# EAGLE design picoWiCopter (EAGLE 6.3)
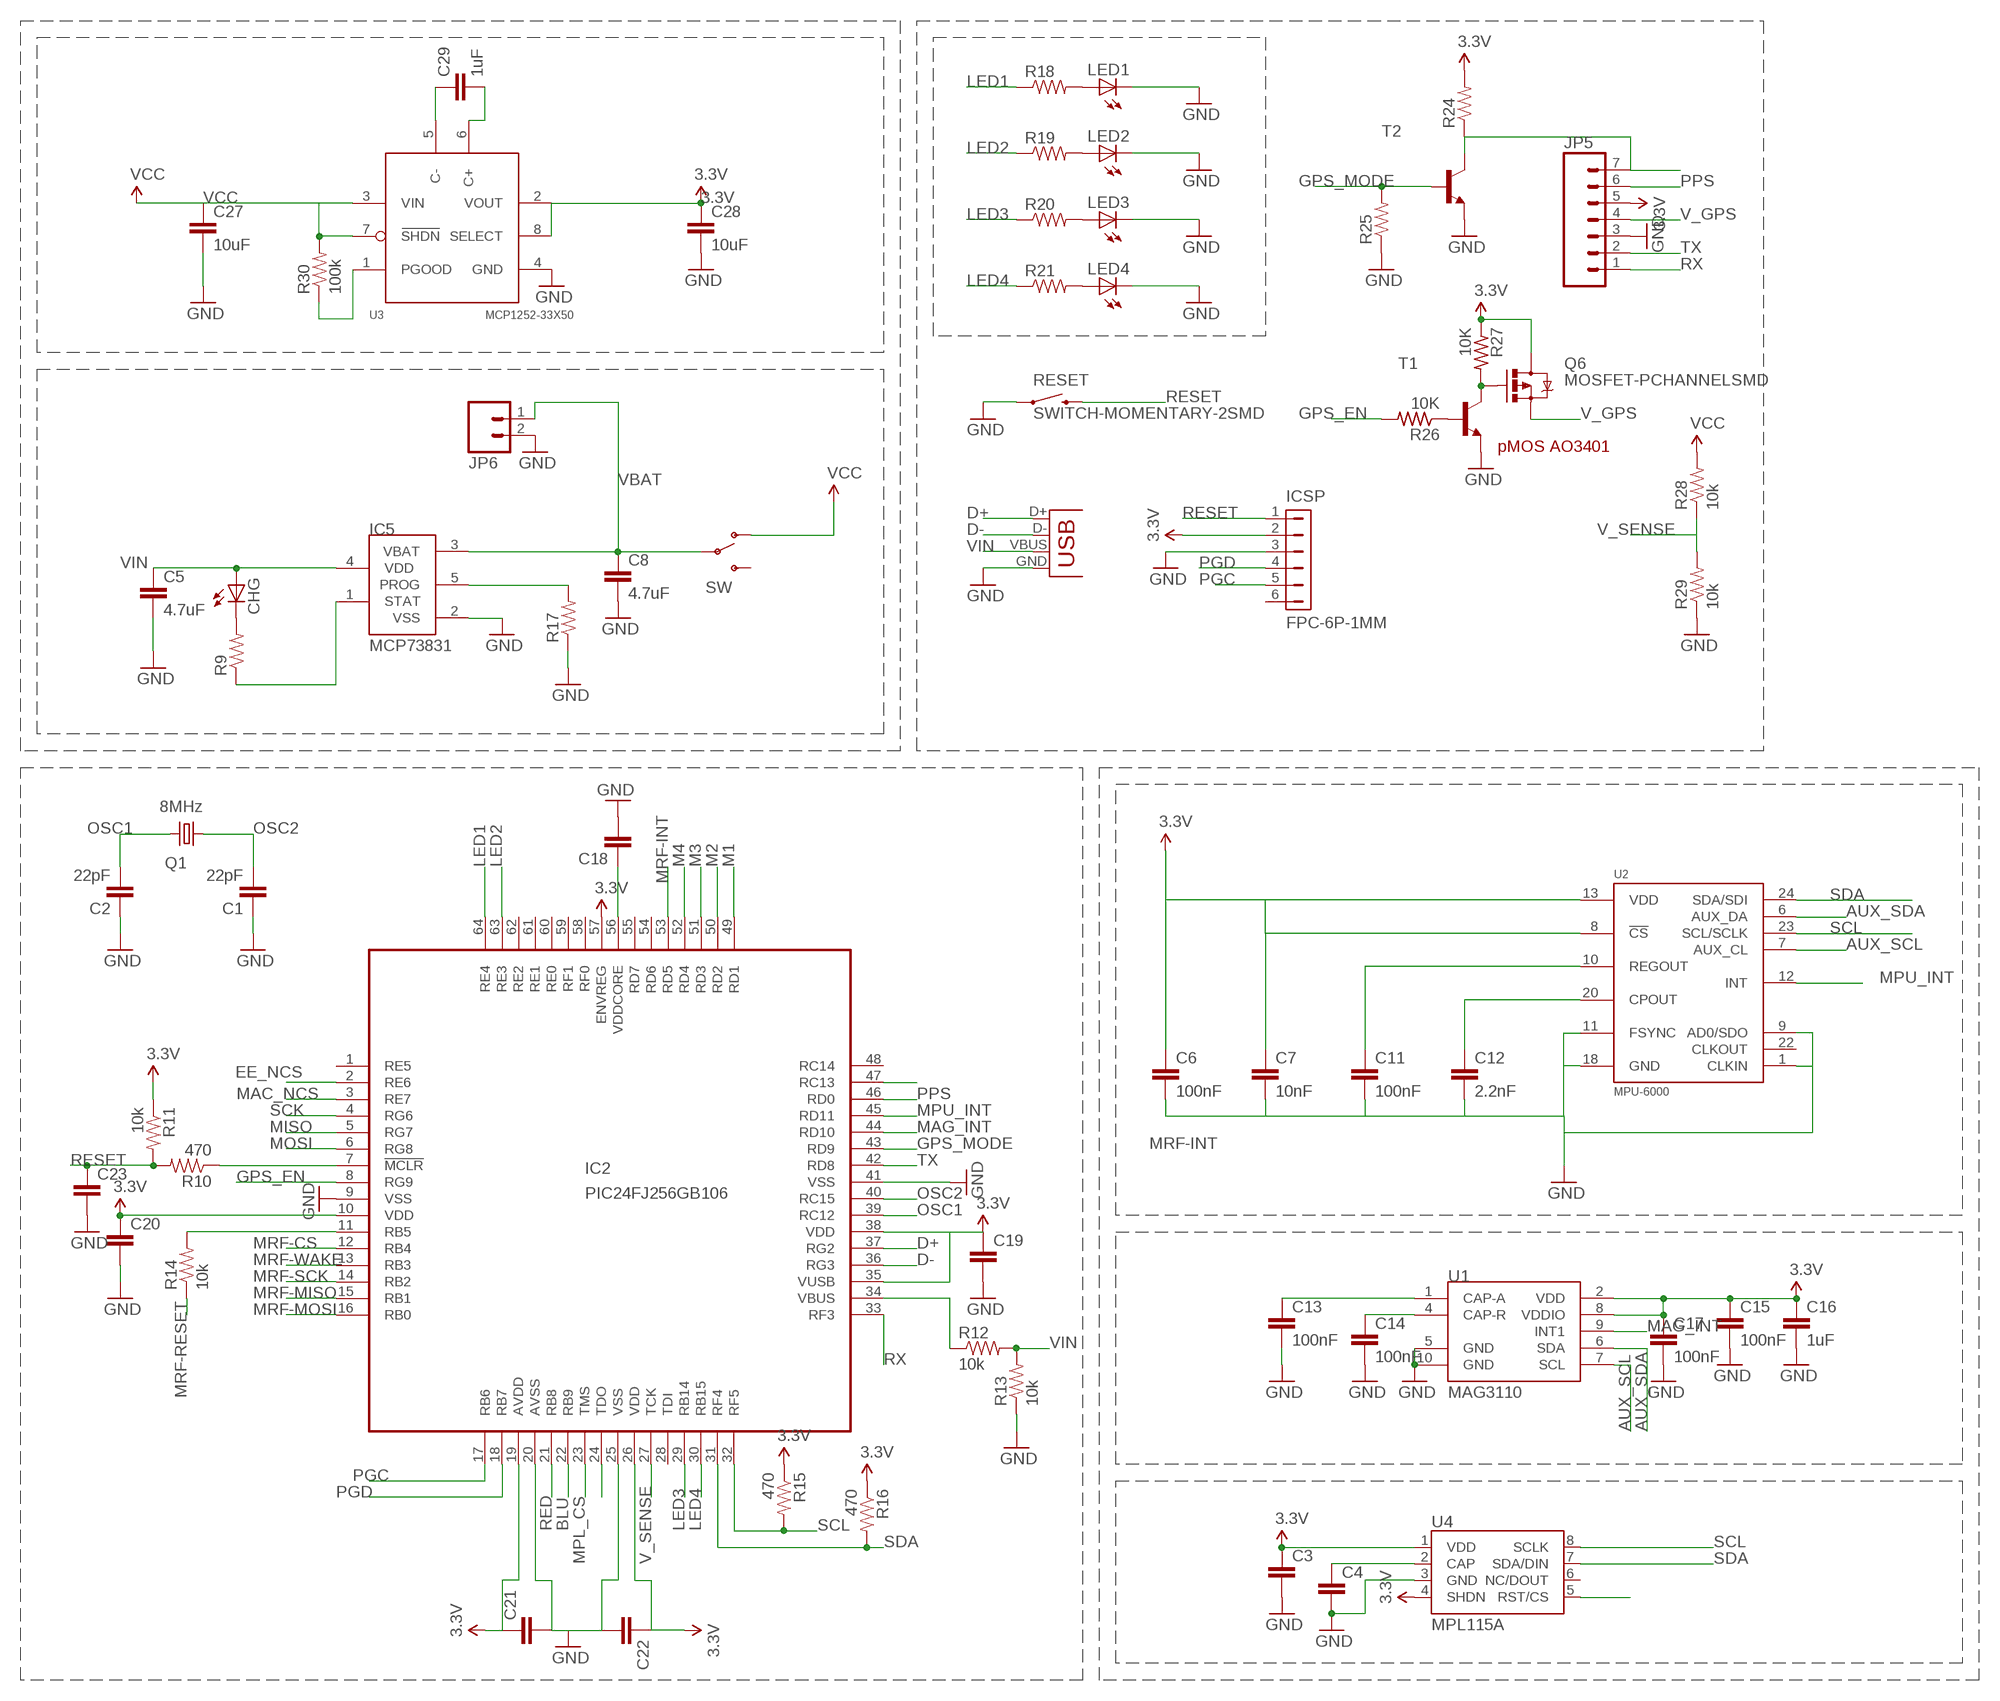
[diagram p0: schematic, sheet 1, part 1 of 2]
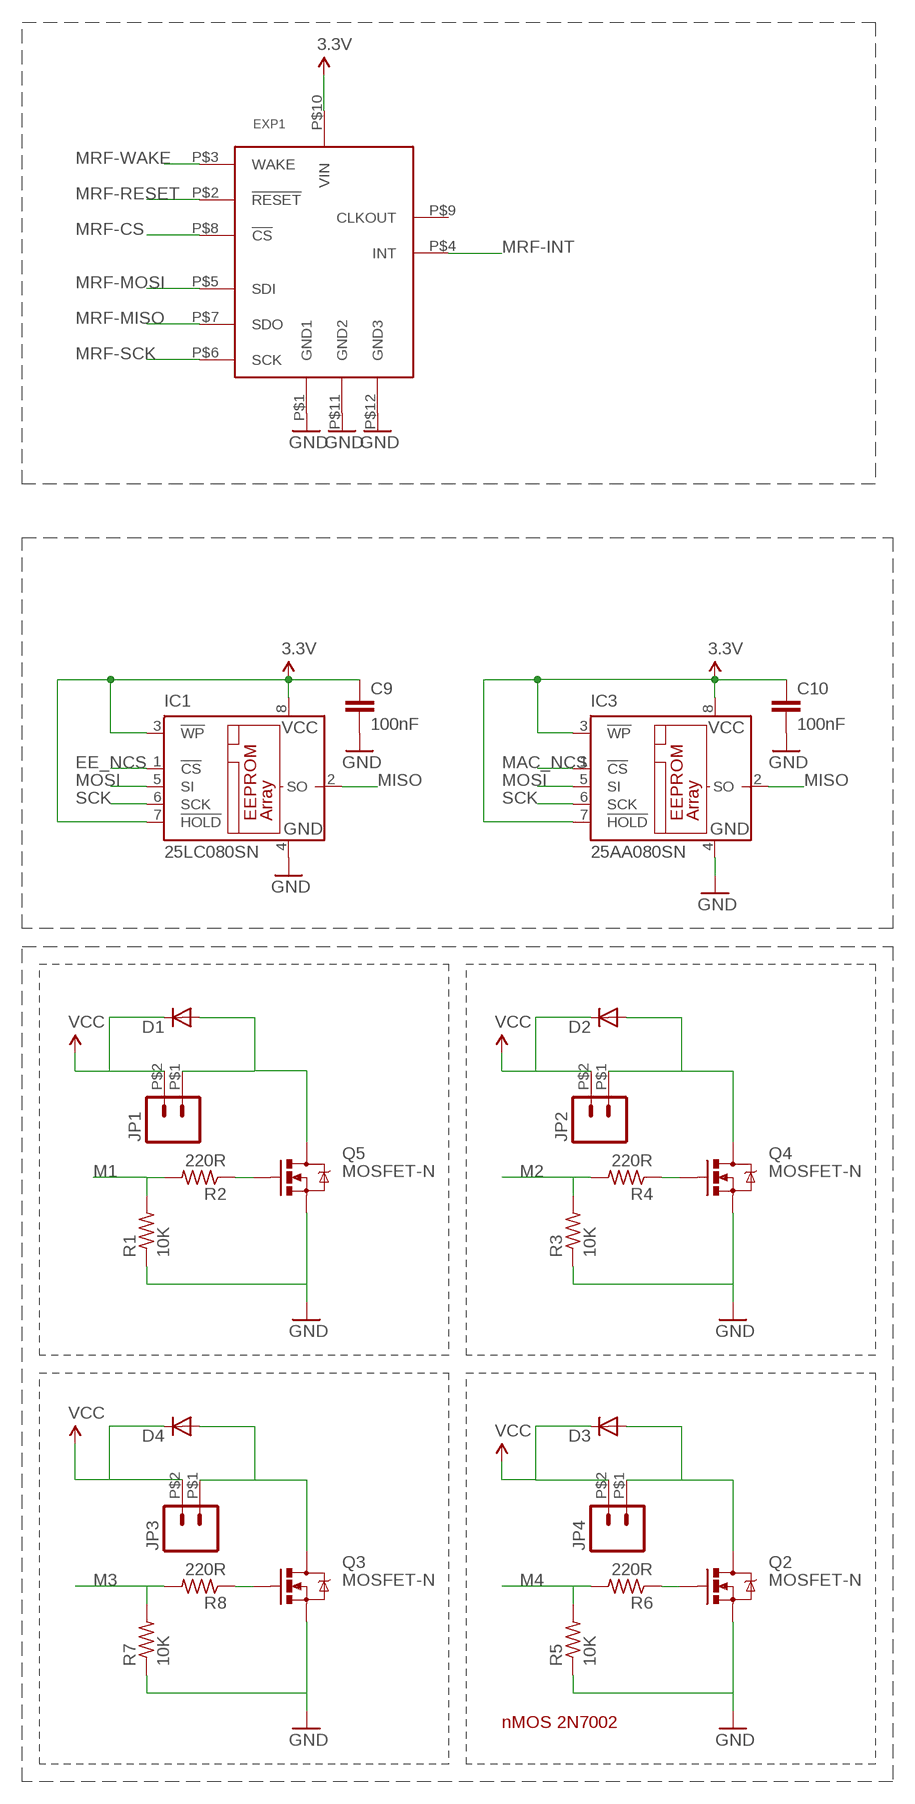
[diagram p1: schematic, sheet 1, part 2 of 2]

## Parts
C1  22pF  CAP0603-CAP  [0603-CAP]
C2  22pF  CAP0603-CAP  [0603-CAP]
C3  CAP0603-CAP  [0603-CAP]
C4  CAP0603-CAP  [0603-CAP]
C5  4.7uF  C-EUC1206  [C1206]
C6  100nF  CAP0603-CAP  [0603-CAP]
C7  10nF  CAP0603-CAP  [0603-CAP]
C8  4.7uF  C-EUC1206  [C1206]
C9  100nF  CAP0603-CAP  [0603-CAP]
C10  100nF  CAP0603-CAP  [0603-CAP]
C11  100nF  CAP0603-CAP  [0603-CAP]
C12  2.2nF  CAP0603-CAP  [0603-CAP]
C13  100nF  CAP0603-CAP  [0603-CAP]
C14  100nF  CAP0603-CAP  [0603-CAP]
C15  100nF  CAP0603-CAP  [0603-CAP]
C16  1uF  CAP0603-CAP  [0603-CAP]
C17  100nF  CAP0603-CAP  [0603-CAP]
C18  CAP1206  [1206]
C19  CAP0603-CAP  [0603-CAP]
C20  CAP0603-CAP  [0603-CAP]
C21  CAP0603-CAP  [0603-CAP]
C22  CAP0603-CAP  [0603-CAP]
C23  CAP0603-CAP  [0603-CAP]
C27  10uF  CAP1206  [1206]
C28  10uF  CAP1206  [1206]
C29  1uF  CAP0603-CAP  [0603-CAP]
CHG  LEDCHIP-LED0603  [CHIP-LED0603]
D1  DIODE-MINIMELF  [MINIMELF]
D2  DIODE-MINIMELF  [MINIMELF]
D3  DIODE-MINIMELF  [MINIMELF]
D4  DIODE-MINIMELF  [MINIMELF]
EXP1  MRF24J40MA"  [MRF24J40MA]
IC1  25LC080SN  [SO-08]
IC2  PIC24FJ256GB106  [TQFP64-10X10]
IC3  25AA080SN  [SO-08]
IC5  MCP73831  [SOT23-5L]
ICSP  FPC-6P-1MM  [FPC-6P-1MM]
JP1  M02  [1X2SMD]
JP2  M02  [1X2SMD]
JP3  M02  [1X2SMD]
JP4  M02  [1X2SMD]
JP5  M07  [1X07]
JP6  M02PTH  [1X02]
LED1  LED0603  [LED-0603]
LED2  LED0603  [LED-0603]
LED3  LED0603  [LED-0603]
LED4  LED0603  [LED-0603]
Q1  8MHz  CRYSTALCTS406  [CTS406]
Q2  MOSFET-N  MOSFET-NCHANNELSMD  [SOT23-3]
Q3  MOSFET-N  MOSFET-NCHANNELSMD  [SOT23-3]
Q4  MOSFET-N  MOSFET-NCHANNELSMD  [SOT23-3]
Q5  MOSFET-N  MOSFET-NCHANNELSMD  [SOT23-3]
Q6  MOSFET-PCHANNELSMD  [SOT23-3]
R1  10K  R-US_R0603  [R0603]
R2  220R  R-US_R0603  [R0603]
R3  10K  R-US_R0603  [R0603]
R4  220R  R-US_R0603  [R0603]
R5  10K  R-US_R0603  [R0603]
R6  220R  R-US_R0603  [R0603]
R7  10K  R-US_R0603  [R0603]
R8  220R  R-US_R0603  [R0603]
R9  RESISTOR0603-RES  [0603-RES]
R10  470  RESISTOR0603-RES  [0603-RES]
R11  10k  RESISTOR0603-RES  [0603-RES]
R12  10k  RESISTOR0603-RES  [0603-RES]
R13  10k  RESISTOR0603-RES  [0603-RES]
R14  10k  RESISTOR0603-RES  [0603-RES]
R15  470  RESISTOR0603-RES  [0603-RES]
R16  470  RESISTOR0603-RES  [0603-RES]
R17  RESISTOR0603-RES  [0603-RES]
R18  RESISTOR0603-RES  [0603-RES]
R19  RESISTOR0603-RES  [0603-RES]
R20  RESISTOR0603-RES  [0603-RES]
R21  RESISTOR0603-RES  [0603-RES]
R24  RESISTOR0603-RES  [0603-RES]
R25  RESISTOR0603-RES  [0603-RES]
R26  10K  R-US_R0603  [R0603]
R27  10K  R-US_R0603  [R0603]
R28  10k  RESISTOR0603-RES  [0603-RES]
R29  10k  RESISTOR0603-RES  [0603-RES]
R30  100k  RESISTOR0603-RES  [0603-RES]
RESET  SWITCH-MOMENTARY-2SMD  [TACTILE_SWITCH_SMD]
SW  SWITCH-SPDTPTH_LOCK  [SWITCH-SPDT_LOCK.007S]
T1  BFR92-NPN-SOT23-BEC  [SOT23-BEC]
T2  BFR92-NPN-SOT23-BEC  [SOT23-BEC]
U1  MAG3110  [DFN-10]
U2  MPU-6000  [QFN-24]
U3  MCP1252-33X50  [MSOP8]
U4  MPL115A  [LGA8]
X3  USBSMD  [USB-MINIB]

## Nets
3.3V: C3.1 C6.1 C7.1 C9.1 C10.1 C15.1 C16.1 C17.1 C19.1 C20.1 C21.1 C22.1 C28.1 EXP1.P$10(VIN) IC1.3(!WP) IC1.7(!HOLD) IC1.8(VCC) IC2.10(VDD) IC2.19(AVDD) IC2.26(VDD) IC2.35(VUSB) IC2.38(VDD) IC2.57(ENVREG) IC3.3(!WP) IC3.7(!HOLD) IC3.8(VCC) ICSP.2 JP5.5 Q6.3(D) R11.1 R15.1 R16.1 R24.2 R27.1 U1.2(VDD) U1.8(VDDIO) U2.8(!CS) U2.13(VDD) U3.2(VOUT) U3.8(SELECT) U4.1(VDD) U4.4(SHDN)
AUX_SCL: U1.7(SCL) U2.7(AUX_CL)
AUX_SDA: U1.6(SDA) U2.6(AUX_DA)
BLU: IC2.22(RB9)
C+1: C29.2 U3.6(C+)
C-1: C29.1 U3.5(C-)
D+: IC2.37(RG2) X3.D+
D-: IC2.36(RG3) X3.D-
EE_NCS: IC1.1(!CS) IC2.2(RE6)
GND: C1.1 C2.1 C3.2 C4.2 C5.2 C6.2 C7.2 C8.2 C9.2 C10.2 C11.2 C12.2 C13.2 C14.2 C15.2 C16.2 C17.2 C18.2 C19.2 C20.2 C21.2 C22.2 C23.2 C27.2 C28.2 EXP1.P$1(GND1) EXP1.P$11(GND2) EXP1.P$12(GND3) IC1.4(GND) IC2.9(VSS) IC2.20(AVSS) IC2.25(VSS) IC2.41(VSS) IC3.4(GND) IC5.2(VSS) ICSP.3 JP5.3 JP6.2 LED1.C LED2.C LED3.C LED4.C Q2.2(S) Q3.2(S) Q4.2(S) Q5.2(S) R1.1 R3.1 R5.1 R7.1 R13.1 R17.1 R25.1 R29.1 RESET.1 T1.E T2.E U1.5(GND) U1.10(GND) U2.1(CLKIN) U2.9(AD0/SDO) U2.11(FSYNC) U2.18(GND) U3.4(GND) U4.3(GND) X3.GND
GPS_EN: IC2.8(RG9) R26.2
GPS_MODE: IC2.43(RD9) R25.2 T2.B
LED1: IC2.64(RE4) R18.1
LED2: IC2.63(RE3) R19.1
LED3: IC2.29(RB14) R20.1
LED4: IC2.30(RB15) R21.1
M1: IC2.49(RD1) R1.2 R2.2
M2: IC2.50(RD2) R3.2 R4.2
M3: IC2.51(RD3) R7.2 R8.2
M4: IC2.52(RD4) R5.2 R6.2
MAC_NCS: IC2.3(RE7) IC3.1(!CS)
MAG_INT: IC2.44(RD10) U1.9(INT1)
MISO: IC1.2(SO) IC2.5(RG7) IC3.2(SO)
MOSI: IC1.5(SI) IC2.6(RG8) IC3.5(SI)
MPL_CS: IC2.23(TMS) U4.5(RST/CS)
MPU_INT: IC2.45(RD11) U2.12(INT)
MRF-CS: EXP1.P$8(!CS) IC2.12(RB4)
MRF-INT: EXP1.P$4(INT) IC2.53(RD5)
MRF-MISO: EXP1.P$7(SDO) IC2.15(RB1)
MRF-MOSI: EXP1.P$5(SDI) IC2.16(RB0)
MRF-RESET: EXP1.P$2(!RESET) R14.1
MRF-SCK: EXP1.P$6(SCK) IC2.14(RB2)
MRF-WAKE: EXP1.P$3(WAKE) IC2.13(RB3)
N$1: IC5.1(STAT) R9.1
N$3: IC2.47(RC13)
N$4: CHG.C R9.2
N$7: C13.1 U1.1(CAP-A)
N$8: C14.1 U1.4(CAP-R)
N$9: D1.A JP1.P$1 Q5.3(D)
N$10: LED1.A R18.2
N$11: C18.1 IC2.56(VDDCORE)
N$12: IC2.34(VBUS) R12.1
N$13: IC2.7(!MCLR) R10.1
N$14: IC2.11(RB5) R14.2
N$15: D2.A JP2.P$1 Q4.3(D)
N$16: C12.1 U2.20(CPOUT)
N$17: C11.1 U2.10(REGOUT)
N$18: LED2.A R19.2
N$20: LED3.A R20.2
N$21: D3.A JP4.P$1 Q2.3(D)
N$22: LED4.A R21.2
N$23: D4.A JP3.P$1 Q3.3(D)
N$24: IC5.5(PROG) R17.2
N$25: JP5.7 R24.1 T2.C
N$26: Q6.1(G) R27.2 T1.C
N$27: R26.1 T1.B
N$29: R30.1 U3.1(PGOOD)
N$35: C4.1 U4.2(CAP)
N$37: IC2.24(TDO)
N$45: Q5.1(G) R2.1
N$46: Q4.1(G) R4.1
N$47: Q2.1(G) R6.1
N$48: Q3.1(G) R8.1
OSC1: C2.2 IC2.39(RC12) Q1.3
OSC2: C1.2 IC2.40(RC15) Q1.1
PGC: IC2.17(RB6) ICSP.5
PGD: IC2.18(RB7) ICSP.4
PPS: IC2.46(RD0) JP5.6
RED: IC2.21(RB8)
RESET: C23.1 ICSP.1 R10.2 R11.2 RESET.3
RX: IC2.33(RF3) JP5.1
SCK: IC1.6(SCK) IC2.4(RG6) IC3.6(SCK)
SCL: IC2.32(RF5) R15.2 U2.23(SCL/SCLK) U4.8(SCLK)
SDA: IC2.31(RF4) R16.2 U2.24(SDA/SDI) U4.7(SDA/DIN)
TX: IC2.42(RD8) JP5.2
V_GPS: JP5.4 Q6.2(S)
V_SENSE: IC2.27(TCK) R28.1 R29.2
VBAT: C8.1 IC5.3(VBAT) JP6.1 SW.2(P)
VCC: C27.1 D1.C D2.C D3.C D4.C JP1.P$2 JP2.P$2 JP3.P$2 JP4.P$2 R28.2 R30.2 SW.1(O) U3.3(VIN) U3.7(SHDN)
VIN: C5.1 CHG.A IC5.4(VDD) R12.2 R13.2 X3.VBUS
Unconnected: EXP1.P$9(CLKOUT) IC2.1(RE5) IC2.28(TDI) IC2.48(RC14) IC2.54(RD6) IC2.55(RD7) IC2.58(RF0) IC2.59(RF1) IC2.60(RE0) IC2.61(RE1) IC2.62(RE2) ICSP.6 SW.3(S) U2.22(CLKOUT) U4.6(NC/DOUT)

## Notes on the sheet
- pMOS AO3401
- VBAT
- nMOS 2N7002

## Library data of the parts
C1-C4 C6 C7 C9-C23 C27-C29 = SparkFun-Passives:CAP: Capacitor Standard 0603 ceramic capacitor, and 0.1" leaded capacitor.
C5 C8 = resistor:C-EU: CAPACITOR, European symbol
CHG = led:LED: LED OSRAM: - CHIPLED LG R971, LG N971, LY N971, LG Q971, LY Q971, LO R971, LY R971 LH N974, LH R974 LS Q976, LO Q976, LY Q976 LO Q996 - Hyper CHIPLED LW Q18S LB Q993, LB Q99A, LB R99A - SideLED LS A670, LO A670, LY A670, LG A670, LP A670 LB A673, LV A673, LT A673, LW A673 LH A674 LY A675 LS A676, LA A676, LO A676, LY A676, LW A676 LS A679, LY A679, LG A679 - Hyper Micro SIDELED® LS Y876, LA Y876, LO Y876, LY Y876 LT Y87S - SmartLED LW L88C, LW L88S LB L89C, LB L89S, LG L890 LS L89K, LO L89K, LY L89K LS L896, LA L896, LO L896, LY L896 - TOPLED LS T670, LO T670, LY T670, LG T670, LP T670 LSG T670, LSP T670, LSY T670, LOP T670, LYG T670 LG T671, LOG T671, LSG T671 LB T673, LV T673, LT T673, LW T673 LH T674 LS T676, LA T676, LO T676, LY T676, LB T676, LH T676, LSB T676, LW T676 LB T67C, LV T67C, LT T67C, LS T67K, LO T67K, LY T67K, LW E67C LS E67B, LA E67B, LO E67B, LY E67B, LB E67C, LV E67C, LT E67C LW T67C LS T679, LY T679, LG T679 LS T770, LO T770, LY T770, LG T770, LP T770 LB T773, LV T773, LT T773, LW T773 LH T774 LS E675, LA E675, LY E675, LS T675 LS T776, LA T776, LO T776, LY T776, LB T776 LHGB T686 LT T68C, LB T68C - Hyper Mini TOPLED® LB M676 - Mini TOPLED Santana® LG M470 LS M47K, LO M47K, LY M47K Source: http://www.osram.convergy.de LUXEON: - LUMILED® LXK2-PW12-R00, LXK2-PW12-S00, LXK2-PW14-U00, LXK2-PW14-V00 LXK2-PM12-R00, LXK2-PM12-S00, LXK2-PM14-U00 LXK2-PE12-Q00, LXK2-PE12-R00, LXK2-PE12-S00, LXK2-PE14-T00, LXK2-PE14-U00 LXK2-PB12-K00, LXK2-PB12-L00, LXK2-PB12-M00, LXK2-PB14-N00, LXK2-PB14-P00, LXK2-PB14-Q00 LXK2-PR12-L00, LXK2-PR12-M00, LXK2-PR14-Q00, LXK2-PR14-R00 LXK2-PD12-Q00, LXK2-PD12-R00, LXK2-PD12-S00 LXK2-PH12-R00, LXK2-PH12-S00 LXK2-PL12-P00, LXK2-PL12-Q00, LXK2-PL12-R00 Source: www.luxeon.com KINGBRIGHT: KA-3528ASYC Source: www.kingbright.com
D1-D4 = palmquad_alpha:DIODE-: DIODE
EXP1 = genericpackages:MRF24J40MA: Microchips MRF24J40MA zigbee module.
IC1 = microchip:25*: Serial EEPROM 4K/ 8K , SPI bus; MF: MICROCHIP; MPN: 25LC080/SN; OC_FARNELL: 1137302; OC_NEWARK: 96K4092
IC2 = microchip:PIC24FJ256GB106: PIC24FJ256GB106 edit this description Auto generated by make-symbol-device-package-bsdl.ulp Rev. 25 Source: PIC24FJ256GB106.bsd; MPN: PIC24FJ256GB106-I/PT; OC_FARNELL: 1576868; OC_NEWARK: 54M5129
IC3 = microchip:25*: Serial EEPROM 4K/ 8K , SPI bus; MF: MICROCHIP; MPN: 25AA080/SN; OC_FARNELL: 1816072; OC_NEWARK: 92C7351
IC5 = microchip-update-2:MCP73831: Miniature Single-Cell, Fully Integrated Li-Ion, Li-Polymer Charge Management Controllers
ICSP = connectors:FPC-6P-1MM
JP1-JP4 JP6 = SparkFun-Connectors:M02: Header 2 Standard 2-pin 0.1" header. Use with straight break away headers (SKU : PRT-00116), right angle break away headers (PRT-00553), swiss pins (PRT-00743), machine pins (PRT-00117), and female headers (PRT-00115). Molex polarized connector foot print use with SKU : PRT-08233 with associated crimp pins and housings.
JP5 = SparkFun-Connectors:M07: Header 7 Standard 7-pin 0.1" header. Use with straight break away headers (SKU : PRT-00116), right angle break away headers (PRT-00553), swiss pins (PRT-00743), machine pins (PRT-00117), and female headers (PRT-00115). NOTES ON THE VARIANTS LOCK and LOCK_LONGPADS... This footprint was designed to help hold the alignment of a through-hole component (i.e. 7-pin header) while soldering it into place. You may notice that each hole has been shifted either up or down by 0.005 of an inch from it's more standard position (which is usually a perfectly straight line). This slight alteration caused the pins (the squares in the middle) to touch the edges of the holes. Because they are alternating, it causes a "brace" to hold the header in place. 0.005 has proven to be the perfect amount of "off-center" position when using our standard breakaway headers. Although looks a little odd when you look at the bare footprint, once you have a header in there, the alteration is very hard to notice. Also, if you push a header all the way into place, it is covered up entirely on the bottom side. This idea of altering the position of holes to aid alignment will be further integrated into the Sparkfun Library for other footprints. It can help hold any component with 3 or more connection pins.
LED1-LED4 = SparkFun-LED:LED: LEDs Standard schematic elements and footprints for 5mm, 3mm, 1206, and 0603 sized LEDs. 5mm - Spark Fun Electronics SKU : COM-00529 (and others)
Q1 = crystal:CRYSTAL: CRYSTAL; OC_FARNELL: unknown; OC_NEWARK: unknown
Q2-Q5 = palmquad_alpha:MOSFET-NCHANNEL
Q6 = SparkFun-DiscreteSemi:MOSFET-PCHANNEL: Generic PMOSFET
R1-R8 R26 R27 = rcl:R-US_: RESISTOR, American symbol
R9-R21 R24 R25 R28-R30 = SparkFun-Passives:RESISTOR: Resistor Basic schematic elements and footprints for 0603, 1206, and PTH resistors.
RESET = SparkFun-Electromechanical:SWITCH-MOMENTARY-2: Various NO switches- pushbuttons, reed, etc
SW = SparkFun-Electromechanical:SWITCH-SPDT: SPST Switch Simple slide switch. Spark Fun Electronics SKU : COM-00102
T1 T2 = transistor:*-NPN-: NPN Transistror BF959 corrected 2008.03.06
U1 = SparkFun-Sensors:MAG3110: 3-axis digital (I2C) magnetometer
U2 = palmquad_alpha:MPU-6000: ITG-3200 3-axis gyro, digital output, qfn24 package
U3 = microchip-mcp125x-xxx:MCP1252-33X50
U4 = SparkFun-Sensors:MPL115A: MPL115A1 (SPI) and MPL115A2 (I2C) Miniature Digital Barometer 5.0x3.0x1.2mm LGA Package
X3 = SparkFun-Connectors:USB: USB Connectors USB-B-PTH is fully proven SKU : PRT-00139 USB-miniB is fully proven SKU : PRT-00587 USB-A-PCB is untested. USB-A-H is throughly reviewed, but untested. Spark Fun Electronics SKU : PRT-00437 USB-B-SMT is throughly reviewed, but untested. Needs silkscreen touching up. USB-A-S has not been used/tested USB-MB-H has not been used/tested

## Board
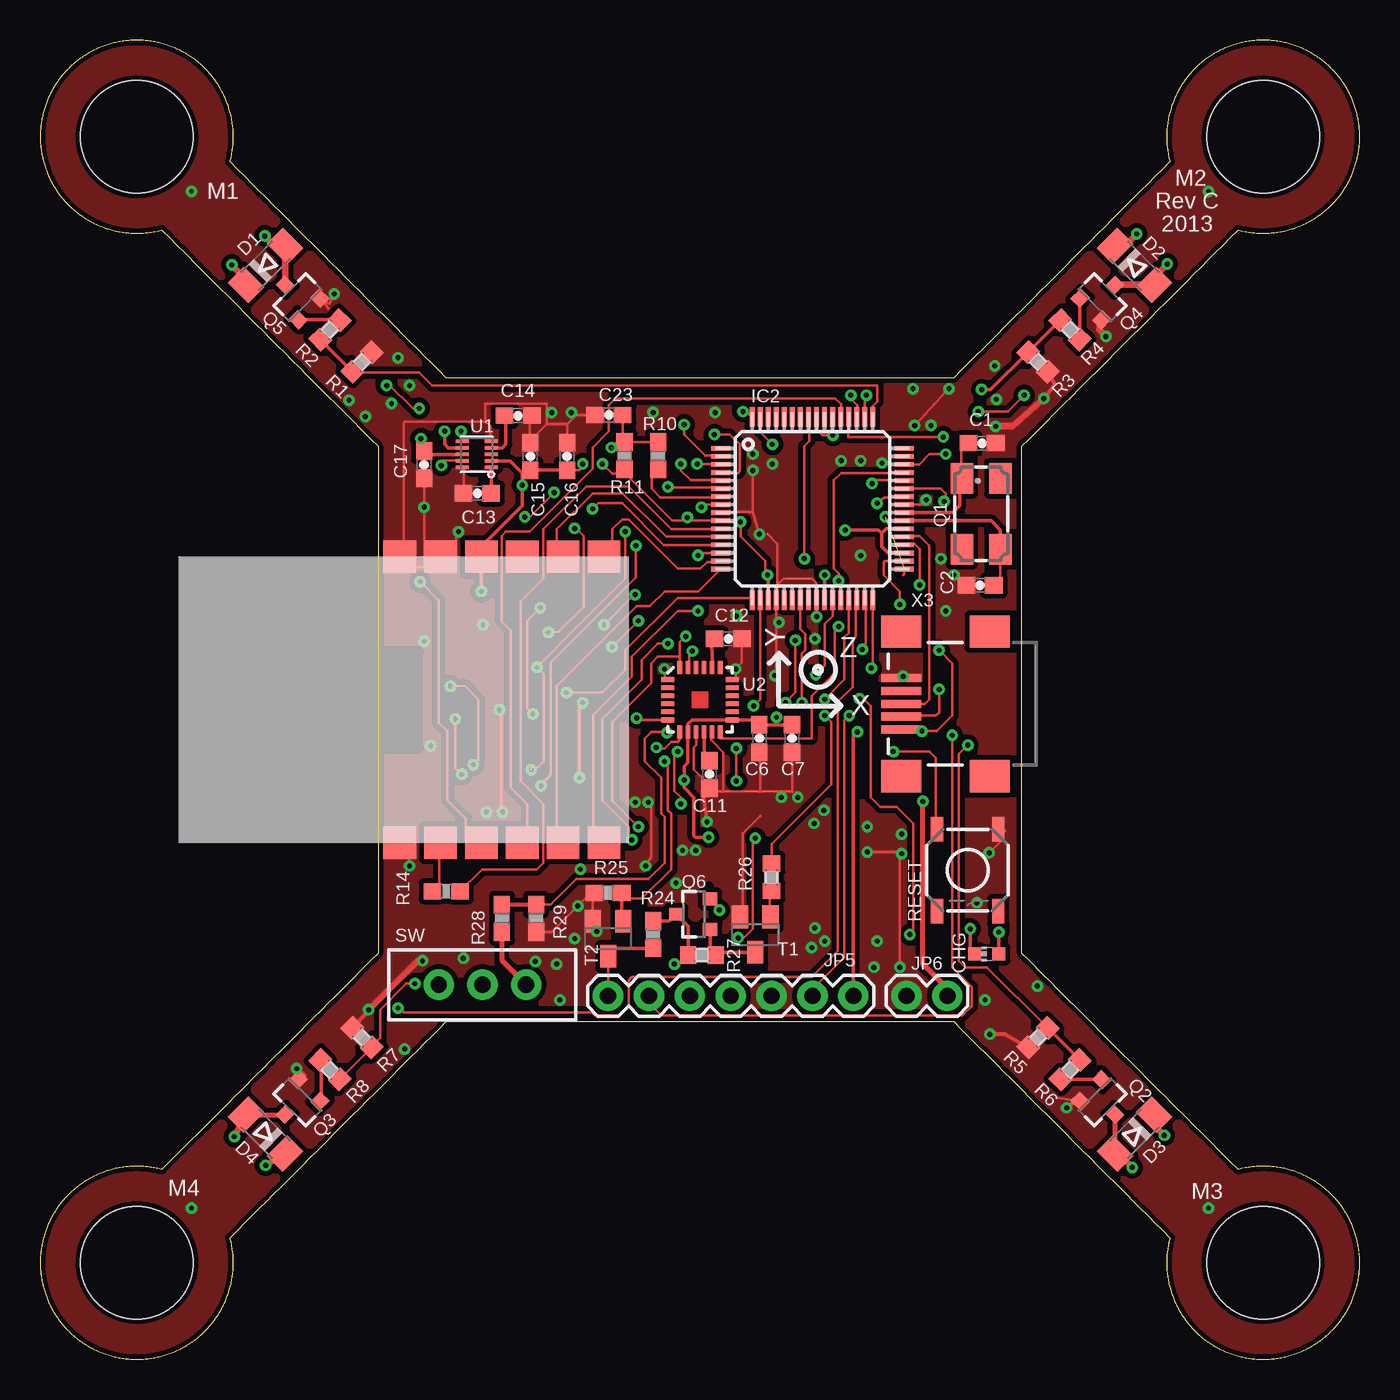
[diagram p2: board, top side]
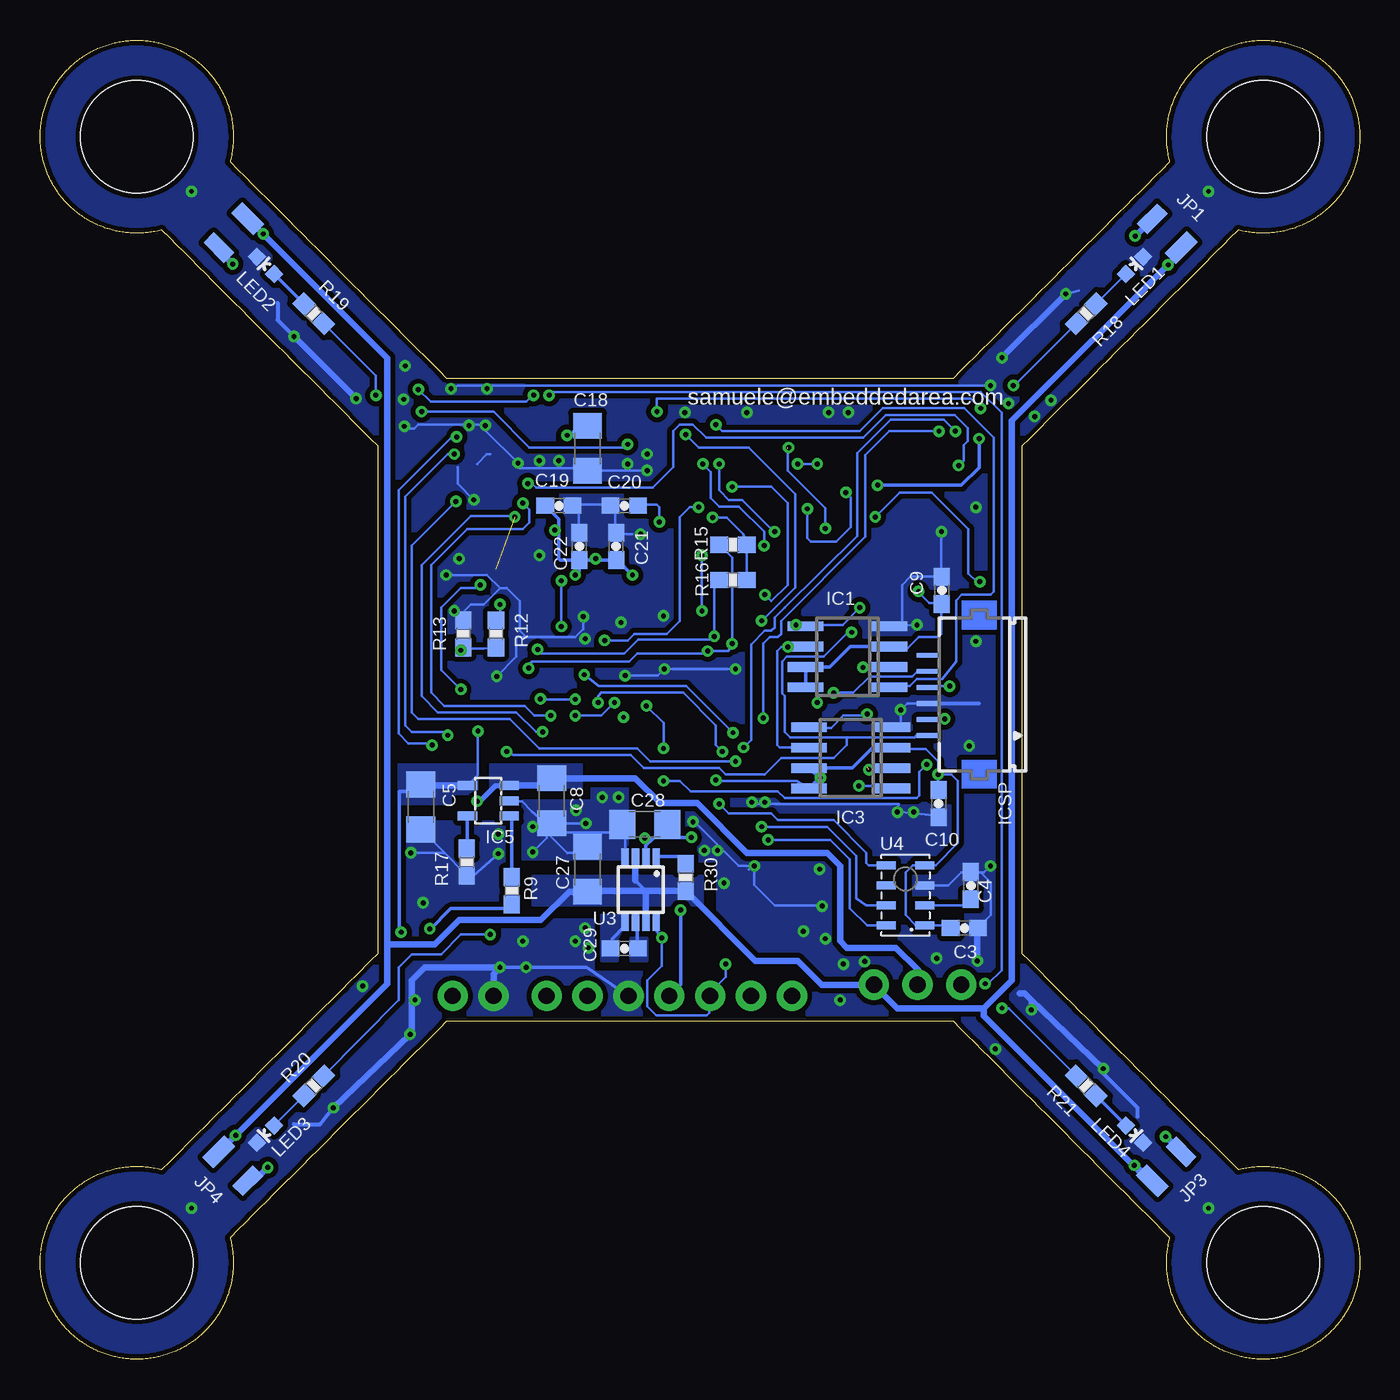
[diagram p3: board, bottom side, seen from below]

Size 82 x 82 mm. Coordinates in mm from the lower left corner, seen from the top.
Outline: 1416 segments
Copper layers (1*16): Top 0.035mm / dielectric 1.5mm / Bottom 0.035mm
Design rules "DFRobot_Eagle_Rule_v0.4": minimum track width 6mil, minimum drill 12mil, track to track 6mil, track to pad 6mil, pad to pad 6mil, via to via 6mil, smd to smd 0mil, copper to edge 10mil, drill to drill 10mil, minimum pad ring 12mil, minimum via ring 8mil, stop-mask expansion 2mil, vias tented up to drill 25mil, thermal gap 10mil
Holes 7 mm at 76,76 6,76 6,6 76,6
tRestrict: area 21,38 to 23.5,44; area 26.7,55.2 to 27.5,57.2; 1 lines

### Footprints (pad centres in the part's own frame; a part is rotated, then mirrored left to right if it is on the bottom)
0603-CAP = smd 1.1 x 1: 1 -0.85,0; 2 0.85,0
C1206 = smd 1.6 x 1.8: 1 -1.4,0; 2 1.4,0
1206 = smd 1.6 x 1.8: 1 -1.4,0; 2 1.4,0
CHIP-LED0603 = smd 0.8 x 0.8: A 0,-0.75; C 0,0.75
MINIMELF = smd 1.4 x 1.8: A 1.7,0; C -1.7,0
MRF24J40MA = smd 2.032 x 2.032: P$1 0,8.89; P$2 -2.54,8.89; P$3 -5.08,8.89; P$4 -7.62,8.89; P$5 -10.16,8.89; P$6 -12.7,8.89; P$7 -12.7,-8.89; P$8 -10.16,-8.89; P$9 -7.62,-8.89; P$10 -5.08,-8.89; P$11 -2.54,-8.89; P$12 0,-8.89
SO-08 = smd 0.6 x 2.2: 1 -1.905,-2.6; 2 -0.635,-2.6; 3 0.635,-2.6; 4 1.905,-2.6; 5 1.905,2.6; 6 0.635,2.6; 7 -0.635,2.6; 8 -1.905,2.6
TQFP64-10X10 = smd 1.2 x 0.3: 1 -5.7,3.75; 2 -5.7,3.25; 3 -5.7,2.75; 4 -5.7,2.25; 5 -5.7,1.75; 6 -5.7,1.25; 7 -5.7,0.75; 8 -5.7,0.25; 9 -5.7,-0.25; 10 -5.7,-0.75; 11 -5.7,-1.25; 12 -5.7,-1.75; 13 -5.7,-2.25; 14 -5.7,-2.75; 15 -5.7,-3.25; 16 -5.7,-3.75; 33 5.7,-3.75; 34 5.7,-3.25; 35 5.7,-2.75; 36 5.7,-2.25; 37 5.7,-1.75; 38 5.7,-1.25; 39 5.7,-0.75; 40 5.7,-0.25; 41 5.7,0.25; 42 5.7,0.75; 43 5.7,1.25; 44 5.7,1.75; 45 5.7,2.25; 46 5.7,2.75; 47 5.7,3.25; 48 5.7,3.75 | smd 0.3 x 1.2: 17 -3.75,-5.7; 18 -3.25,-5.7; 19 -2.75,-5.7; 20 -2.25,-5.7; 21 -1.75,-5.7; 22 -1.25,-5.7; 23 -0.75,-5.7; 24 -0.25,-5.7; 25 0.25,-5.7; 26 0.75,-5.7; 27 1.25,-5.7; 28 1.75,-5.7; 29 2.25,-5.7; 30 2.75,-5.7; 31 3.25,-5.7; 32 3.75,-5.7; 49 3.75,5.7; 50 3.25,5.7; 51 2.75,5.7; 52 2.25,5.7; 53 1.75,5.7; 54 1.25,5.7; 55 0.75,5.7; 56 0.25,5.7; 57 -0.25,5.7; 58 -0.75,5.7; 59 -1.25,5.7; 60 -1.75,5.7; 61 -2.25,5.7; 62 -2.75,5.7; 63 -3.25,5.7; 64 -3.75,5.7
SOT23-5L = smd 0.55 x 1.2: 1 -0.95,-1.3; 2 0,-1.3; 3 0.95,-1.3; 4 0.95,1.3; 5 -0.95,1.3
FPC-6P-1MM = smd 0.3 x 1.3: 1 -2.23,3.25; 2 -1.23,3.25; 3 -0.23,3.25; 4 0.77,3.25; 5 1.77,3.25; 6 2.77,3.25
1X2SMD = smd 0.914 x 1.778: P$1 -1.27,0 | smd 0.965 x 1.93: P$2 1.27,0
1X07 = drill 1.016 pad 1.88: 1 0,0; 2 2.54,0; 3 5.08,0; 4 7.62,0; 5 10.16,0; 6 12.7,0; 7 15.24,0
1X02 = drill 1.016 pad 1.88: 1 0,0; 2 2.54,0
LED-0603 = smd 0.8 x 0.8: A 0,-0.75; C 0,0.75
CTS406 = smd 1.9 x 1.4: 1 -2.2,-1.2; 2 2.2,-1.2; 3 2.2,1.2; 4 -2.2,1.2
SOT23-3 = smd 0.8 x 0.9: 1 -0.95,-1; 2 0.95,-1; 3 0,1.1
R0603 = smd 1 x 1.1: 1 -0.85,0; 2 0.85,0
0603-RES = smd 1.1 x 1: 1 -0.85,0; 2 0.85,0
TACTILE_SWITCH_SMD = smd 1.524 x 0.762: 1 -2.54,1.905; 2 2.54,1.905; 3 -2.54,-1.905; 4 2.54,-1.905
SWITCH-SPDT_LOCK.007S = drill 1.016 pad 1.88: 1 0,2.718; 2 0,0; 3 0,-2.718
SOT23-BEC = smd 1 x 1.4: B -0.95,-1.1; C 0,1.1; E 0.95,-1.1
DFN-10 = smd 0.8 x 0.22: 1 -0.91,0.8; 2 -0.91,0.4; 3 -0.91,0; 4 -0.91,-0.4; 5 -0.91,-0.8; 6 0.91,-0.8; 7 0.91,-0.4; 8 0.91,0; 9 0.91,0.4; 10 0.91,0.8
QFN-24 = smd 0.8 x 0.3: 1 -2,1.25; 2 -2,0.75; 3 -2,0.25; 4 -2,-0.25; 5 -2,-0.75; 6 -2,-1.25; 13 2,-1.25; 14 2,-0.75; 15 2,-0.25; 16 2,0.25; 17 2,0.75; 18 2,1.25 | smd 0.3 x 0.8: 7 -1.25,-2; 8 -0.75,-2; 9 -0.25,-2; 10 0.25,-2; 11 0.75,-2; 12 1.25,-2; 19 1.25,2; 20 0.75,2; 21 0.25,2; 22 -0.25,2; 23 -0.75,2; 24 -1.25,2
MSOP8 = smd 0.45 x 1: 1 -0.975,-2.05; 2 -0.325,-2.05; 3 0.325,-2.05; 4 0.975,-2.05; 5 0.975,2.05; 6 0.325,2.05; 7 -0.325,2.05; 8 -0.975,2.05
LGA8 = smd 1.2 x 0.5: 1 -1.2,1.875; 2 -1.2,0.625; 3 -1.2,-0.625; 4 -1.2,-1.875; 5 1.2,-1.875; 6 1.2,-0.625; 7 1.2,0.625; 8 1.2,1.875
USB-MINIB = smd 2.5 x 0.5: D+ 2.5,0; D- 2.5,0.8; GND 2.5,-1.6; ID 2.5,-0.8; VBUS 2.5,1.6 | smd 2.5 x 2: MTN1 -3,4.5; MTN2 2.5,4.5; MTN3 -3,-4.5; MTN4 2.5,-4.5

### Placement (x,y rotation side)
C1  58.53,56.94 180 top
C2  58.4,48.12 0 top
C3  24.57,26.81 0 bottom
C4  24.16,29.45 90 bottom
C5  58.34,34.34 270 bottom
C6  44.69,38.59 270 top
C7  46.72,38.59 270 top
C8  50.21,34.72 270 bottom
C9  25.97,47.8 90 bottom
C10  26.17,34.54 270 bottom
C11  41.59,36.36 270 top
C12  42.76,44.79 0 top
C13  27.16,53.83 180 top
C14  29.7,58.66 0 top
C15  30.46,56.12 90 top
C16  32.75,56.12 90 top
C17  23.86,55.61 270 top
C18  47.99,56.63 270 bottom
C19  49.77,53.07 0 bottom
C20  45.7,53.07 180 bottom
C21  46.21,50.53 90 bottom
C22  48.5,50.53 90 bottom
C23  35.34,58.7 180 top
C27  47.99,30.46 90 bottom
C28  44.43,33.26 180 bottom
C29  45.7,25.54 0 bottom
CHG  58.82,25.19 90 top
D1  14,68 45 top
D2  68,68 315 top
D3  68,14 225 top
D4  14,14 135 top
EXP1  22.34,41 180 top
IC1  31.84,43.67 90 bottom
IC2  47.99,52.88 0 top
IC3  31.63,37.39 90 bottom
IC5  54.15,34.72 90 bottom
ICSP  23.64,41 90 bottom
JP1  12,70 315 bottom
JP2  70,70 45 bottom
JP3  12,12 225 bottom
JP4  70,12 135 bottom
JP5  50.53,22.59 180 top
JP6  56.37,22.59 180 top
LED1  14,68 315 bottom
LED2  68,68 45 bottom
LED3  68,14 135 bottom
LED4  14,14 225 bottom
Q1  58.47,52.56 270 top
Q2  66,16 225 top
Q3  16,16 135 top
Q4  66,66 315 top
Q5  16,66 45 top
Q6  40.62,27.67 90 top
R1  20,62 225 top
R2  18,64 225 top
R3  62,62 135 top
R4  64,64 135 top
R5  62,20 45 top
R6  64,18 45 top
R7  20,20 315 top
R8  18,18 315 top
R9  52.69,29.13 270 bottom
R10  38.4,56.17 90 top
R11  36.31,56.17 90 top
R12  53.68,45.09 270 bottom
R13  55.71,45.09 270 bottom
R14  25.23,29.09 0 top
R15  38.95,50.63 180 bottom
R16  38.95,48.45 180 bottom
R17  55.48,30.91 90 bottom
R18  17,65 45 bottom
R19  65,65 135 bottom
R20  65,17 225 bottom
R21  17,17 315 bottom
R24  38.08,26.4 90 top
R25  35.29,28.99 0 top
R26  45.45,29.96 90 top
R27  41.13,25.13 0 top
R28  28.69,27.42 270 top
R29  30.82,27.42 90 top
R30  41.89,29.96 270 bottom
RESET  57.63,30.4 270 top
SW  27.48,23.29 270 top
T1  44.43,26.4 180 top
T2  35.29,26.15 180 top
U1  27.13,56.25 180 top
U2  41,41 0 top
U3  44.69,29.19 180 bottom
U4  28.23,28.84 180 bottom
X3  56,40.75 180 top

### Tracks (layer width: path | path; a pad name or v marks a point on that pad's centre or on a via)
3.3V  (via drill 0.3)
  Top 0.152: 46.72,39.1 C7.1 45.75,39.44 v45.75,39.91 | v43.37,26.2 43.52,25.99 44.28,26.76 44.28,32.24 v44.43,32.39 | v47.48,49.77 47.48,56.78 47.79,57.08 47.79,58.46 IC2.57 | 42.15,52.05 IC2.10 | IC2.10 42.3,52.05 v43.52,52.05 43.52,51.14 45.04,49.62 45.04,49.16 45.2,49.01 v45.2,48.75 | 36.31,55.1 R11.1 36.1,54.9 | IC2.10 40.42,52.13 v40.22,52.33 40.22,52.21 40.01,52.13 39.28,52.13 36.51,54.9 36.1,54.9 | v25.79,39.81 25.79,36.76 v26.2,36.36 | R27.1 40.23,25.18 39.62,24.57 v39.4,24.57 | 36.1,54.9 35.95,55.05 35.54,55.05 v34.93,55.66 | v33.71,55.66 33.5,55.27 C16.1
  Top 0.203: v27.42,47.74 EXP1.P$10 27.42,50.53 29.96,53.07 v29.96,54.34 29.96,55.1 | U1.8 24.07,56.25 C17.1 v23.66,57.24 | U1.2 29.21,55.85 29.96,55.1 | 29.96,55.1 30.3,55.1 C15.1 C16.1 | C7.1 C6.1 44.38,39.75 U2.13 40.51,39.75 40.25,39.49 U2.8 40.25,37.1 40.01,36.87 v40.01,36 40.01,35.54 40.62,34.93 40.62,32.55 40.73,32.45 v41.54,32.45 | R24.2 39.1,27.25 Q6.3 40.28,26.91 R27.1 40.37,25.04 | v45.2,48.75 45.24,48.71 IC2.19 | IC2.26 48.75,47.19 v48.75,48.75 | IC2.38 52.56,51.63 52.31,51.38 | IC2.35 52.71,50.13 52.31,50.53 52.31,51.38 | v33.71,40.83 33.51,40.62 v33.51,36.15 | v50.02,51.55 52.07,51.55 52.31,51.38
  Bottom 0.152: v44.43,32.39 43.98,32.39 43.94,32.36 | U3.8 43.67,27.06 43.67,26.6 v43.37,26.2 43.37,24.47 44.28,23.56 44.28,21.93 43.72,21.37 40.57,21.37 40.42,21.52 40.42,22.54 JP5.5 40.37,22.79 39.4,23.76 v39.4,24.57 | v47.48,49.77 47.48,49.68 | 28.63,44.21 28.1,44.21 27.42,44.89 26.2,44.89 25.99,45.09 25.99,46.92 C9.1 25.99,47.03 26.76,47.03 27.36,47.63 v27.42,47.74 | 28.54,37.93 26.96,37.93 26.2,37.17 v26.2,36.36 | C10.1 26.2,35.82 v26.2,36.36 | v43.52,52.05 43.52,52.97 43.67,53.12 44.74,53.12 C20.1 | ICSP.2 25.83,39.77 v25.79,39.81 | v40.01,36 40.06,36 39.61,35.95 34.98,35.95 IC3.8 | v26.2,36.36 25.38,36.36 24.98,35.95 24.98,32.09 26.35,30.71 U4.4 27.78,30.71 28.23,30.26 28.23,27.62 27.62,27.01 27.07,27.01 U4.1 25.58,26.96 C3.1 | 33.7,41.89 33.7,41.62 v33.71,40.83 | v34.93,55.66 v33.71,55.66 | R16.1 R15.1 38.3,51.31 39.33,52.33 v40.22,52.33
  Bottom 0.203: U3.2 44.36,31.93 43.94,32.36 C28.1 42.22,32.45 v41.54,32.45 | 28.63,44.21 IC1.3 31.66,44.31 32.93,43.04 IC1.7 IC1.8 33.7,41.89 | IC3.3 28.63,37.98 | IC3.3 30.27,38.02 31.54,36.75 33.5,36.75 33.51,36.76 v33.51,36.15 | IC3.3 28.54,37.93 | v29.96,54.34 24.76,54.34 23.66,55.44 v23.66,57.24 | v45.2,48.75 46.12,49.68 C21.1 47.48,49.68 C22.1 | v48.75,48.75 48.5,49.01 C22.1 | C19.1 49.77,52.22 49.77,51.29 | 49.77,51.29 49.77,49.77 49.68,49.68 C22.1 | v50.02,51.55 49.77,51.29 | IC3.8 33.56,36.15 v33.51,36.15 | IC3.7 33.64,36.15 v33.51,36.15
AUX_SCL  (via drill 0.3)
  Top 0.152: U2.7 39.75,38.53 39.61,38.39 39.2,38.39 38.79,37.98 38.34,37.98 v38.29,38.03
  Top 0.203: U1.7 25.36,56.65 25.13,56.88 v25.13,57.69
  Bottom 0.152: v38.29,38.03 37.83,38.49 37.83,44.43 36.97,45.3 36.56,45.3 36.36,45.5 36.36,46.11 35.75,46.72 31.23,51.19 31.23,56.32 29.14,58.4 25.84,58.4 v25.13,57.69
AUX_SDA  (via drill 0.3)
  Top 0.152: U2.6 37.18,39.75 v37.07,39.86
  Top 0.203: U1.6 26.22,57.83 v26.15,57.69
  Bottom 0.152: v26.15,57.69 29.24,57.69 30.72,56.22 30.72,51.14 35.95,45.91 35.95,45.09 36.15,44.89 36.66,44.89 37.07,44.49 v37.07,39.86
C+1
  Bottom 0.203: U3.6 45.01,26.73 44.89,26.6 44.89,25.96 C29.2
  pour Bottom (isolate 0.305, no thermals): 45.3,26.2 45.3,24.77 44.28,24.77 44.28,26.2
C-1
  Bottom 0.203: U3.5 45.66,26.95 46.47,26.15 46.47,25.47 C29.1
  pour Bottom (isolate 0.305, no thermals): 45.91,27.62 47.13,27.62 47.13,24.77 46.11,24.77 46.11,26.2 45.91,26.6
D+
  Top 0.152: X3.D+ 54.97,40.75 55.25,41.03 55.25,50.58 54.64,51.19 53.75,51.19 IC2.37
D-  (via drill 0.3)
  Top 0.152: IC2.36 53.73,50.68 54.34,50.68 54.64,50.38 v54.64,48.14 | X3.D- 54.19,40.01 55.66,40.01 55.86,40.22 v55.86,41.64
  Bottom 0.152: v55.86,41.64 57.08,42.86 57.08,46.72 55.86,47.94 54.85,47.94 v54.64,48.14
EE_NCS  (via drill 0.3)
  Top 0.152: IC2.2 42.15,56.17 41.33,56.17 40.01,57.49 v40.01,58.1
  Bottom 0.152: IC1.1 29.19,41.84 27.97,41.84 27.52,42.3 25.94,42.3 25.08,43.37 25.08,47.18 24.72,47.53 22.95,47.53 22.74,47.74 22.74,57.29 24.57,59.12 29.65,59.12 31.07,57.69 39.61,57.69 v40.01,58.1
GND  (via drill 0.3)
  Top 0.152: 63.23,16.24 Q2.2 | 31.48,58.15 30.41,57.08 | 30.41,57.08 30.21,56.88 C15.2 30.41,57.08 | 32.75,58.15 31.48,58.15 | 32.75,58.15 C16.2 32.75,56.88 | 23.86,50.53 23.86,49.26 22.59,49.26 EXP1.P$12 22.59,50.53 22.59,58.2 22.69,58.3 27.67,58.3 | 23.86,50.53 C17.2 | 22.59,32.75 EXP1.P$1 22.95,31.5 v22.95,30.67 | 23.86,50.53 25.13,50.53 EXP1.P$11 | 25.13,49.26 EXP1.P$11 | 31.48,58.15 31.48,59.42 27.67,59.42 27.67,58.3 | 44.74,35.29 46.72,35.29 C7.2 46.72,37.83 | 44.74,35.29 42.45,35.29 | 42.45,35.29 41.64,35.29 C11.2 41.39,35.9 40.62,36.66 40.62,38.03 40.78,38.19 40.78,38.95 U2.9 | v56.78,48.75 58,48.09 57.69,48.09 C2.1 57.54,48.09 | 54.34,42.3 X3.GND 54.03,42.31 | 59.98,32.85 RESET.1 59.74,32.26 v58.96,31.48 | 54.19,42.3 54.03,42.31 | v38.79,42.91 38.79,42.3 38.95,42.3 U2.1 | U2.18 43.06,42.15 43.21,42.3 v43.21,42.91 43.61,43.3 C12.2 | 45.81,47.18 IC2.20 | v48.24,46.16 IC2.25 48.24,48.25 47.94,48.55 46.21,48.55 45.81,48.14 | 44.28,52.66 42.3,52.66 IC2.9 | v44.69,51.29 44.28,52.66 | v44.28,55.25 44.28,52.66 | 45.81,48.14 45.81,50.68 45.2,51.29 | 45.81,48.14 45.81,47.33 IC2.20 | 26.6,53.88 26.45,53.73 C13.2 | U1.10 26.3,55.41 26.31,55.39 C13.2 | U1.5 27.97,57.08 27.97,58 27.67,58.3 | 30.41,57.08 30.41,58.61 C14.2 | 26.3,53.88 C13.2 | EXP1.P$11 25.08,49.46 25.08,49.62 25.69,49.62 25.84,49.77 25.84,51.44 v25.99,51.44 | 42.45,35.29 42.45,37.73 41.69,38.49 41.69,38.95 U2.11 | 44.74,35.29 44.74,37.73 C6.2 | 43.52,27.52 T1.E 43.67,27.5 43.67,32.7 44.74,33.77 | v28.53,40.37 28.63,40.32 28.63,34.07 v28.74,34.02 | 17.92,65.31 Q5.2 17.66,65.72 17.97,65.62 v18.27,66.23 | IC2.20 45.74,42.59 v45.65,42.5 | v51.39,31.53 53.43,31.53 v53.53,31.43 53.43,31.12 v53.43,24.37
  Top 0.152: T2.E 34.34,28.89 | 34.34,28.89 R25.1 | 34.34,28.89 34.12,28.89 v33.41,28.18 31.8,26.57 R29.1 | C23.2 33.3,58.7 32.75,58.15 | v56.47,60.33 56.63,60.54 v54.34,58.05 | v53.63,42.45 53.77,42.31 54.03,42.31 | v37.78,34.63 37.78,34.53 37.98,34.33 37.98,31.23 v37.63,30.67 | IC2.41 54.75,53.13 v55.05,53.43 | 16.24,17.46 16.24,17.51 Q3.2 16.24,17.46
  Top 0.203: 41.64,35.29 41.23,34.88 v41.44,33.41
  Top 0.254: R7.1 20.41,21.67 v20.41,21.73 | v63.79,15.63 64.24,16 Q2.2 | R5.1 59.98,20.2 v59.01,20.2 | R3.1 63.06,60.62 v62.37,59.73
  Top 0.406: 16.24,17.51 arc90 16.34,17.61 v15.93,18.07 | v66.23,63.59 65.81,64 Q4.2 | v59.37,58 60.44,58 v62.37,59.73 | v23.76,24.77 23.45,24.77 v20.41,21.73
  Bottom 0.152: v27.52,45.65 27.67,45.65 28.2,45.63 | 28.2,45.63 IC1.4 | 56.9,31.51 58.15,32.75 C5.2 | 56.9,31.51 55.61,30.21 R17.1 55.1,30.06 v53.53,31.43 | 50.53,32.75 45.45,32.75 C28.2 45.65,32.7 45.65,31.33 U3.4 | 50.53,32.75 49.26,31.48 47.99,31.48 C27.2 | 50.53,32.75 C8.2 | IC3.4 28.94,39.1 28.53,39.51 v28.53,40.37 28.13,40.78 26.91,40.78 ICSP.3 26.76,40.78 | IC5.2 52.82,34.68 52.05,34.68 51.44,34.07 50.83,33.51 50.22,33.31 C8.2 | v58.96,31.48 56.93,31.48 56.9,31.51 | 48.55,53.12 48.55,51.44 C22.2 | 48.55,53.12 46.57,53.12 C20.2 46.41,53.12 46.26,53.12 46.26,51.44 C21.2 46.11,51.29 45.2,51.29 | 48.55,53.12 48.85,53.12 C19.2 | v59.37,58 59.22,57.85 58.76,57.85 58.51,58.1 54.49,58.1 v54.34,58.05 54.34,57.74 v52.31,55.71 52.21,55.41 48.55,55.41 48.4,55.25 48.09,55.25 C18.2 47.94,55.25 v44.28,55.25 | v48.09,33.31 50.07,33.31 C8.2 | C10.2 26.3,33.77 27.77,33.97 v28.74,34.02 28.63,34.53 37.68,34.53 v37.78,34.63 | v25.99,51.44 25.99,48.7 C9.2 27.92,48.65 28.43,48.14 28.43,45.85 28.2,45.63 | v18.27,66.23 17.46,66.43 | C3.2 23.72,26.84 22.95,27.62 22.95,29.65 23.55,30.26 | 23.55,30.26 24.13,30.26 C4.2 24.2,30.26 24.77,30.26 25.57,29.46 U4.3 | v37.63,30.67 37.98,30.46 | 23.55,30.26 23.35,30.26 v22.95,30.67 | v22.95,60.54 56.07,60.54 v56.47,60.33 | v48.24,46.16 48.24,45.4 48.75,44.89 51.8,44.89 | 51.8,44.89 52.41,44.89 52.41,43.67 v53.63,42.45 | 50.53,32.75 50.53,32.39 v51.39,31.53 | v37.63,30.67 37.63,29.5 36.36,28.23 33.46,28.23 v33.41,28.18 | v45.65,42.5 43.62,42.5 v43.21,42.91 v38.79,42.91 | R13.1 55.71,46.47 55.25,46.92 54.44,46.92 53.43,47.94 | 53.43,47.94 53.02,47.94 52.21,47.13 52.21,45.3 51.8,44.89
  Bottom 0.152: v56.78,48.75 54.24,48.75 53.43,47.94 | v41.44,33.41 41.33,33.41 38.59,30.67 v37.63,30.67 | v55.05,53.43 56.07,54.44 56.07,55.46 | 54.85,55.66 54.24,56.27 54.03,56.27
  Bottom 0.203: 26.76,40.78 23.66,40.78 | JP5.3 48.04,24.37 v53.43,24.37
  Bottom 0.254: 13.8,15.08 13.8,15.63 15.93,17.76 v15.93,18.07 | v20.41,21.73 20.46,21.78 20.46,22.39 | 66.22,14.61 64.6,14.61 v63.79,15.63 | 67.24,65.67 67.24,64.6 v66.23,63.59
  Bottom 0.406: v15.93,18.07 20.46,22.39 20.81,22.74 21.12,22.74 | v63.79,15.63 v59.01,20.2 58.91,20.3 58.91,23.56 58.1,24.37 v53.43,24.37 53.83,23.96 JP6.2 | v62.37,59.73 v66.23,63.59 | v18.27,66.23 v22.23,62.27 | C3.2 23.76,26.77 v23.76,24.77
  other vias: 51.39,33.11 47.08,34.93 50.99,49.97 56.27,46.52 24.27,38.14 58.71,22.34 32.09,24.57 32.29,22.34 23.86,52.97 31.78,58.86 41.94,58.86 38.08,58.86 59.42,59.67 20.2,58.61 72.6,72.6 9.4,9.4 72.6,9.4 9.4,72.6 23.86,44.64 49.77,55.86 45.91,45.81 48.14,44.79 43.27,46.21 33.21,26.15 30.77,24.72 26.3,24.93 39.91,31.63 33,58.86 19.19,59.62 21.83,59.42 59.32,61.76 46.06,34.93 52,25.99 48.14,26.81 51.8,24.37 55.97,49.77 61.96,23.2 53.53,32.65 58.2,28.38 47.94,25.59 34.58,26.6 33.56,30.46 39.51,29.6 48.75,25.99 48.7,34.12 54.24,60.33 55.36,58.05 50.99,55.86 44.28,56.27 45.5,55.66 27.72,34.02 40.73,31.63 36.97,34.63 22.64,19.29
  pour Bottom (isolate 0.305, no thermals): 45.5,31.07 45.5,35.54 47.74,35.54 47.74,34.73 52,34.73 52,31.07
  pour Bottom (isolate 0.305, no thermals): 20.91,25.18 20.91,57.08 7.5,70.09 7.1,70.29 arc-90 -0.02,73.34 arc-90 4.45,82.08 5.67,82.28 arc-90 11.97,77.61 11.77,74.56 25.18,61.15 57.08,60.94 57.08,61.35 70.29,74.36 arc-90 72.93,81.47 74.15,82.08 arc-76 80.86,79.84 arc-4 81.87,77.81 arc-132 74.15,70.09 60.94,56.47 60.94,55.25 61.15,37.78 42.05,37.78 41.84,31.07 39.81,31.07 39.81,27.01 42.45,27.01 42.25,23.96 47.74,23.96 47.74,27.21 53.02,27.21 53.02,33.31 60.74,33.31 60.94,24.77 74.56,11.77 76.18,12.18 arc-90 81.87,6.08 81.87,4.25 arc-90 76.39,-0.02 75.17,-0.02 arc-90 70.09,6.89 70.09,7.5 56.88,20.91 56.47,21.12 25.18,20.91 12.18,7.5 arc-90 7.3,0.19 6.28,-0.02 arc-90 0.19,4.45 0.19,5.47 arc-90 5.27,12.18 7.5,11.97
  pour Top (isolate 0.305, no thermals): 21.12,27.82 20.91,56.88 7.71,70.09 4.25,70.09 3.84,70.49 arc-90 -0.02,75.78 0.19,77 arc-191 11.77,74.36 25.18,61.15 56.88,61.15 70.29,74.36 70.09,77 arc-90 76.39,81.87 77.61,81.87 arc-90 81.87,75.57 81.87,74.76 arc-90 76.39,70.29 75.57,70.09 arc90 74.15,69.89 60.94,56.47 60.94,24.98 74.36,11.77 74.96,11.77 arc-90 81.87,7.91 81.87,7.1 arc-90 78.62,0.59 76.39,-0.02 arc-90 69.88,5.88 70.29,7.3 56.88,20.91 56.47,21.12 25.18,20.91 12.18,7.5 12.18,7.3 arc-90 5.67,-0.22 arc-131 1.61,10.35 arc-46 7.3,11.97 7.71,11.77 21.12,25.38
GPS_EN  (via drill 0.3)
  Top 0.152: v41.08,52.97 41.23,53.12 42.15,53.12 IC2.8 | 45.5,30.87 R26.2 45.45,32.04 49.16,35.75 49.16,39.61 v48.75,40.01 | v46.92,44.69 46.92,41.44 v46.31,40.83
  Bottom 0.152: v41.08,52.97 41.64,52.97 42.25,52.36 42.25,45.91 43.06,45.09 45.09,45.09 45.5,44.69 v46.92,44.69 | v46.31,40.83 47.13,40.01 v48.75,40.01
GPS_MODE  (via drill 0.3)
  Top 0.152: 53.58,54.19 IC2.43 55.97,54.13 56.27,53.83 56.27,53.43 v56.17,53.32 | 36.14,28.64 37.37,28.64 39.2,30.46 39.2,33.92 39,34.12 39,36.97 v38.79,37.17
  Top 0.203: R25.2 36.14,28.64 36.14,27.35 T2.B
  Bottom 0.152: v56.17,53.32 58.91,50.58 58.91,40.22 58.51,39.81 52.82,39.81 50.99,37.98 44.89,37.98 44.08,37.17 v38.79,37.17
LED1  (via drill 0.3)
  Top 0.152: v43.67,58.91 44.08,58.74 IC2.64 | v23.55,59.12 23.15,59.12 21.73,60.54 v21.52,60.54
  Bottom 0.152: v43.67,58.91 43.67,59.73 24.16,59.73 v23.55,59.12 | R18.1 21.46,60.54 v21.52,60.54
LED2  (via drill 0.3)
  Top 0.152: v58.3,58.91 60.13,58.91 v61.15,59.93 | v45.5,56.88 44.74,57.64 IC2.63
  Bottom 0.152: v58.3,58.91 53.83,58.91 51.6,56.68 45.7,56.68 v45.5,56.88 | v61.15,59.93 61.15,61.15 R19.1
LED3  (via drill 0.3)
  Top 0.152: 50.22,47.33 IC2.29 50.24,45.16 49.97,44.89 49.97,42.25 v48.75,41.03 | v50.92,41.05 51.17,41.05 51.6,40.62 51.6,34.93 52.21,34.33 53.22,34.33 54.24,33.31 54.24,26.6 v54.03,26.4
  Bottom 0.152: v54.03,26.4 55.86,26.4 57.08,25.18 58.91,25.18 59.72,24.37 59.72,22.34 R20.1 | v48.75,41.03 50.89,41.03 v50.92,41.05
LED4  (via drill 0.3)
  Top 0.152: IC2.30 50.68,47.18 50.68,44.94 50.48,44.74 50.48,41.79 49.56,40.88 49.56,25.38 47.94,23.76 36.76,23.76 36.56,23.56 36.56,21.93 36,21.37 34.48,21.37 34.27,21.57 22.59,21.57 v22.23,21.83
  Bottom 0.152: R21.1 21.83,21.83 v22.23,21.83
M1
  Top 0.152: IC2.49 51.74,59.26 52,59.52 52,60.54 24.37,60.54 23.55,61.35 19.45,61.35 R1.2
  Top 0.203: R2.2 R1.2
M2  (via drill 0.3)
  Top 0.152: IC2.50 51.24,59.83 v51.34,59.93
  Top 0.203: v58.51,60.28 59.04,60.28 R3.2 R4.2
  Bottom 0.152: v58.51,60.28 57.74,59.52 51.8,59.52 51.39,59.93 v51.34,59.93
M3  (via drill 0.3)
  Top 0.152: IC2.51 50.78,58.54 50.78,59.32 50.38,59.73 v50.38,59.93 | v23.28,23.35 22.74,23.35 21.12,21.73 21.12,19.98 20.6,19.46 R7.2 R8.2
  Bottom 0.152: v50.38,59.93 50.38,60.13 23.55,60.13 22.26,58.84 22.26,24.17 23.07,23.35 v23.28,23.35
M4  (via drill 0.3)
  Top 0.152: IC2.52 50.22,58.46 50.22,57.34 v56.12,57.34 | v57.64,38.19 57.08,37.63 57.08,37.22 57.08,24.77 57.49,24.37 58.83,24.37 R5.2
  Top 0.203: R6.2 R5.2
  Bottom 0.152: v56.12,57.34 56.42,57.34 59.72,54.04 59.72,38.9 59.11,38.29 57.74,38.29 v57.64,38.19
MAC_NCS  (via drill 0.3)
  Top 0.152: 31.73,36.36 v31.12,35.65 31.73,36.36 | IC2.3 42.15,55.56 42.05,55.66 v40.83,55.66 | 31.73,36.36 31.73,43.31 37.02,48.6 v37.02,50.58
  Bottom 0.152: 29.04,35.44 IC3.1 29.2,35.65 v31.12,35.65 | v40.83,55.66 40.32,55.15 40.32,53.53 39.81,53.02 38.59,53.02 37.02,51.44 v37.02,50.58
MAG_INT  (via drill 0.3)
  Top 0.152: v24.93,55.56 24.93,55.86 26.15,55.86 U1.9 | IC2.44 53.73,54.65 51.95,54.65 v51.7,54.44
  Bottom 0.152: v24.93,55.56 24.62,55.86 24.62,56.83 24.37,57.08 24.37,57.9 25.18,58.71 29.45,58.71 30.87,57.29 40.62,57.29 41.44,58.1 42.25,58.1 42.66,57.69 42.66,55.46 43.93,54.19 51.19,54.19 51.44,54.44 v51.7,54.44
MISO  (via drill 0.3)  (1 unrouted)
  Top 0.152: IC2.5 42.15,54.65 40.42,54.65 39.81,55.25 v39.81,55.66 | v30.51,36.66 30.77,36.66 31.28,37.17 31.28,42.61 v30.87,43.01 33.31,45.5 36.36,48.55 v36.36,51.44
  Bottom 0.152: v30.87,43.01 29.35,43.06 IC1.2 | 30.57,36.81 29.04,36.81 IC3.2 | v39.81,55.66 39.81,54.04 39.2,53.43 38.39,53.43 36.41,51.44 v36.36,51.44
MOSI  (via drill 0.3)
  Top 0.152: IC2.6 42.3,54.19 39.05,54.19 v39,54.24 | v30.62,40.12 30.57,40.12 30.26,40.42 30.26,45.91 v31.07,46.72 | v35.04,45.65 36.92,47.53 v36.97,47.53
  Bottom 0.152: v30.62,40.12 30.72,40.01 32.09,40.01 32.85,39.25 34.22,39.25 IC3.5 | v39,54.24 36.56,54.24 35.54,53.22 35.54,48.14 36.56,47.13 v36.97,47.53 | 35.19,45.5 v35.04,45.65 34.53,45.65 IC1.5 34.38,45.65 32.14,45.65 v31.07,46.72
MPL_CS  (via drill 0.3)
  Top 0.152: IC2.23 47.24,45.39 47.53,45.09 47.53,44.08 47.33,43.88 v47.33,40.83 | v39.61,37.78 39.4,37.58 39.4,35.34 39.81,34.93 v39.81,34.53
  Bottom 0.152: U4.5 30.51,30.71 30.67,30.87 30.67,31.48 32.7,33.51 36.15,33.51 36.56,33.92 39.2,33.92 v39.81,34.53 | v47.33,40.83 47.33,41.23 47.13,41.44 42.05,41.44 40.01,39.41 40.01,38.19 v39.61,37.78
MPU_INT  (via drill 0.3)
  Top 0.152: v49.62,48.4 49.62,48.85 49.31,49.16 49.31,54.65 49.77,55.1 53.58,55.1 IC2.45 | U2.12 42.25,38.59 47.94,38.59 47.94,41.23 49.36,42.66 49.36,45.3 v49.62,45.55
  Top 0.203: U2.12
  Bottom 0.152: v49.62,45.55 v49.62,48.4
MRF-CS
  Top 0.152: 33.46,49.92 32.55,49.92 EXP1.P$8 32.09,50.3 32.09,51.6 34.32,53.83 36.2,53.83 38.9,51.14 42.15,51.14 IC2.12
MRF-INT
  Top 0.152: 29.24,32.29 29.96,32.09 EXP1.P$4 30.26,32.42 30.26,34.53 29.24,35.54 29.24,45.3 28.69,45.86 28.69,51.19 28.94,51.44 30.41,51.44 34.32,55.36 34.32,56.68 35.34,57.69 35.34,59.32 35.75,59.73 49.41,59.73 49.77,59.37 49.77,58.61 IC2.53
MRF-MISO
  Top 0.152: EXP1.P$7 35.34,49.89 35.54,50.09 35.54,51.6 36.15,52.21 36.56,52.21 39.61,49.16 41.03,49.16 41.44,49.57 42.22,49.57 arc90 IC2.15
MRF-MOSI
  Top 0.152: EXP1.P$5 32.09,32.52 32.09,41.84 37.07,46.82 37.88,46.82 38.79,47.74 40.9,47.74 IC2.16
MRF-RESET
  Top 0.152: 24.79,31.77 24.79,29.5 R14.1
  Top 0.203: EXP1.P$2 24.79,31.77
MRF-SCK  (via drill 0.3)
  Top 0.152: 42.15,50.07 IC2.14 41.19,50.13 v40.88,49.97 | EXP1.P$6 35.14,32.09 34.38,32.29 34.38,40.07 36.76,42.45 36.76,43.67 39.61,46.52 v40.88,46.52
  Bottom 0.152: v40.88,46.52 v40.88,49.97
MRF-WAKE  (via drill 0.3)
  Top 0.152: 42.3,50.68 IC2.13 38.75,50.63 36.15,53.22 34.68,53.22 v34.32,52.87 | EXP1.P$3 27.36,32.09 26.6,32.09 26.45,32.24 26.45,33.61 25.28,34.78 25.28,39.05 24.77,39.56 24.77,47.18 v23.61,48.35 | v30.11,52.36 30.41,52.36 v31.94,53.88
  Bottom 0.152: v31.94,53.88 31.63,53.58 31.63,51.75 32.55,50.84 34.12,50.84 34.32,51.04 v34.32,52.87 | v30.11,52.36 28.58,53.88 26.6,53.88 24.32,51.6 24.32,48.85 23.81,48.35 v23.61,48.35
N$1
  Bottom 0.203: IC5.1 52.69,33.77 R9.1
N$4  (via drill 0.3)
  Top 0.203: v57.79,26.76 57.81,25.13 arc90 CHG.C
  Bottom 0.152: 52.49,28.08 R9.2
  Bottom 0.203: R9.2 52.94,28.03 56.47,28.03 57.79,26.71 v57.79,26.76
N$7
  Top 0.203: U1.1 28.04,53.86 C13.1
N$8
  Top 0.203: U1.4 28.71,56.65 28.94,56.88 28.94,58.32 C14.1
N$9  (via drill 0.3)
  Top 0.406: v13.96,69.83 14.59,69.2 D1.A 15.22,69.18 Q5.3
  Bottom 0.406: JP1.P$1 v13.96,69.83
N$10
  Bottom 0.152: R18.2 LED1.A
N$11  (via drill 0.3)
  Top 0.152: IC2.56 48.24,58.46 48.24,57.79 48.6,57.44 v49.26,57.44
  Bottom 0.152: C18.1 48.09,58 48.29,58 v49.26,57.44
N$12  (via drill 0.3)
  Top 0.152: IC2.34 52.47,49.63 52.41,49.57 52.41,48.75 53.43,47.74 v53.43,46.92
  Bottom 0.152: v53.43,46.92 53.43,46.1 R12.1
N$13
  Top 0.152: IC2.7 42.15,53.58 38.54,53.58 37.99,54.13 37.99,54.85 R10.1
N$14
  Top 0.152: IC2.11 42.26,51.6 39.2,51.6 36.56,54.24 33.92,54.24 31.25,51.6 31.25,48.52 29.85,47.13 29.85,35.95 31.25,34.53 31.25,30.87 30.87,30.46 27.45,30.46 R14.2
N$15  (via drill 0.3)
  Top 0.406: v70.04,68.09 69.2,67.26 D2.A 66.8,66.8 Q4.3
  Bottom 0.406: JP2.P$1 70.9,68.95 v70.04,68.09
N$16
  Top 0.203: U2.20 41.75,43.78 41.74,44.38 C12.1
N$17
  Top 0.203: U2.10 41.25,37.55 C11.1
N$18
  Bottom 0.203: R19.2 LED2.A
N$20
  Bottom 0.152: R20.2 LED3.A
N$21  (via drill 0.3)
  Top 0.305: Q2.3 66.78,12.82 D3.A
  Top 0.406: D3.A 66.99,12.8 v67.86,11.92
  Bottom 0.406: JP4.P$1 68.68,11.1 v67.86,11.92
N$22
  Bottom 0.203: R21.2 LED4.A
N$23  (via drill 0.3)
  Top 0.305: D4.A 15.2,15.2 Q3.3
  Top 0.406: D4.A v12.07,13.84
  Bottom 0.406: v12.07,13.84 JP3.P$1
N$24
  Bottom 0.203: IC5.5 55.45,31.79 arc90 R17.2
N$25
  Top 0.152: JP5.7 T2.C 35.29,25.13
  Top 0.203: R24.1 35.79,25.55 T2.C
N$26
  Top 0.203: T1.C 42.15,25.3 R27.2 41.62,25.49 Q6.1
N$27
  Top 0.152: 45.35,29.04 R26.1 45.35,29 45.35,27.52 T1.B
N$29
  Bottom 0.203: U3.1 42.33,31.24 R30.1
N$35
  Bottom 0.152: U4.2 24.55,28.21 C4.1
N$45
  Top 0.152: 18.58,64.62 R2.1
  Top 0.203: Q5.1 18.58,64.62
N$46
  Top 0.203: Q4.1 64.6,65.95 R4.1
N$47
  Top 0.203: R6.1 65.94,17.4
  Top 0.305: 65.94,17.4 Q2.1
N$48
  Top 0.152: 17.51,16.24 Q3.1
  Top 0.203: 17.46,16.29 17.46,18.48
  Top 0.254: 17.51,16.24 17.46,16.29 | 17.46,18.48 17.76,18.78 R8.1
OSC1
  Top 0.152: C2.2 59.37,48.09 59.67,48.09 59.67,50.23 Q1.3
  Top 0.203: IC2.39 59.09,52.13 59.67,51.55 Q1.3
OSC2
  Top 0.152: C1.2 57.54,56.93 57.24,56.93 57.24,54.8 Q1.1
  Top 0.203: IC2.40 56.69,52.63 57.13,53.07 57.13,54.63 Q1.1
PGC  (via drill 0.3)
  Top 0.152: v32.7,41.44 34.93,41.44 36.36,42.86 36.36,44.08 39.61,47.33 44.09,47.33 IC2.17 44.23,47.18
  Bottom 0.152: ICSP.5 27.12,42.77 | ICSP.5 26.29,42.77 | ICSP.5 27.5,42.77 27.82,42.45 30.46,42.45 31.48,41.44 v32.7,41.44
PGD  (via drill 0.3)
  Top 0.152: v26.91,36.97 27.21,37.27 27.21,41.03 26.4,41.84 v25.49,41.84 | IC2.18 44.74,41.03 v44.33,40.62 | v43.27,37.98 v43.27,35.95
  Bottom 0.152: v26.91,36.97 27.36,36.51 27.36,35.04 27.52,34.88 35.75,34.88 36.15,35.29 41.59,35.29 42.25,35.95 v43.27,35.95 | v25.49,41.84 26.76,41.84 ICSP.4 | v43.27,37.98 43.27,39.56 v44.33,40.62
PPS  (via drill 0.3)
  Top 0.152: IC2.46 54.61,55.63 55.25,56.27 v56.27,56.27 | v56.68,38.8 56.68,24.37 57.9,23.15 57.9,21.93 57.29,21.37 38.59,21.37 37.83,22.13 JP5.6
  Bottom 0.152: v56.27,56.27 56.68,56.27 59.32,53.63 59.32,39.41 58.91,39 56.88,39 v56.68,38.8
RESET  (via drill 0.3)  (1 unrouted)
  Top 0.152: 55.86,33 RESET.3 55.66,33.21 55.66,37.37 55.25,37.78 v53.02,37.78 | R11.2 36.1,56.94 35.76,56.94 v35.49,56.68 | R10.2 R11.2 | R11.2 36.23,56.88 | v33.21,51.65 33.31,51.65 33.77,51.19 33.77,46.77 32.19,45.2 v31.58,45.2 | C23.1 36.19,57.14 R11.2
  Bottom 0.152: 31.89,38.64 27.67,38.64 27.52,38.8 26.91,38.8 ICSP.1 26.87,38.8 | 31.89,38.64 35.39,38.64 35.75,39 35.75,41.23 35.9,41.39 35.9,43.37 35.59,43.67 33.31,43.67 31.78,45.2 v31.58,45.2 | v53.02,37.78 52.61,37.58 45.3,37.58 44.48,36.76 39.81,36.76 39.4,36.36 36.97,36.36 35.95,37.37 32.7,37.37 31.89,38.19 31.89,38.64 | v33.21,51.65 33.21,52.92 35.54,55.25 35.54,56.63 | v35.49,56.68 35.54,56.68
RX  (via drill 0.3)  (1 unrouted)
  Top 0.152: IC2.33 53.69,48.81 53.63,48.75
  Top 0.203: JP5.1 50.53,38.74 v50.78,39
  Bottom 0.152: v52.51,52.36 52.56,52.41 55.25,52.41 58.3,49.36 58.3,41.23 57.29,40.22 52.41,40.22 51.19,39 v50.78,39
SCK  (via drill 0.3)
  Top 0.152: IC2.4 42.3,55.1 43.37,55.1 43.47,55.2 43.47,56.88 42.86,57.49 v41.89,57.49 | v37.17,45.91 v35.54,44.28
  Bottom 0.152: IC1.6 34.53,44.28 v35.54,44.28 35.95,44.28 36.2,44.03 36.2,38.19 36.05,38.03 34.38,38.03 IC3.6 | v37.17,45.91 35.09,47.99 35.09,53.78 37.98,56.68 41.08,56.68 v41.89,57.49
SCL  (via drill 0.3)
  Top 0.152: 40.32,43.06 40.32,42.91 U2.23 40.32,43.06 | IC2.32 51.75,43.06 v51.65,42.96 | v39,44.49 38.39,44.49 37.37,43.47 37.37,42.25 34.93,39.81 34.93,34.73 36.56,33.11 36.56,32.5 v36.76,32.29 | 40.32,43.06 40.32,43.82 v40.52,44.03
  Bottom 0.152: U4.8 30.62,26.96 31.68,28.03 31.68,31.07 32.9,32.29 v36.76,32.29 | v51.65,42.96 51.44,43.37 45.4,43.37 44.89,43.88 40.67,43.88 v40.52,44.03 39.25,44.03 v39,44.49 39,49.83 R15.2
SDA  (via drill 0.3)
  Top 0.152: v51.09,44.13 51.29,44.49 51.29,47.18 IC2.31 | v37.17,33.11 35.54,34.73 35.54,39.61 37.98,42.05 37.98,43.27 38.39,43.67 39.75,43.67 | 39.75,43.67 U2.24 39.75,43.12 | 39.75,43.67 39.75,44.58 v40.12,44.94
  Bottom 0.152: R16.2 40.1,47.96 40.1,44.96 v40.12,44.94 40.32,44.74 44.84,44.74 45.7,43.88 51.04,43.88 v51.09,44.13 | U4.7 29.44,28.23 30.67,28.23 31.28,28.64 31.28,31.28 33.11,33.11 v37.17,33.11
TX  (via drill 0.3)
  Top 0.152: IC2.42 53.73,53.58 52.46,53.58 v52,53.22 | JP5.2 47.99,23 49.97,24.98 49.97,39.71 v50.28,40.01
  Bottom 0.152: v52,53.22 51.6,52.82 51.6,52 52,51.6 55.46,51.6 57.69,49.36 57.69,41.44 56.88,40.62 51.9,40.62 51.29,40.01 v50.28,40.01
V_GPS  (via drill 0.3)
  Top 0.203: Q6.2 41.71,28.62 v42.2,27.92
  Bottom 0.203: v42.2,27.92 42.2,23.3 JP5.4
V_SENSE  (via drill 0.3)
  Top 0.152: 28.74,28.28 R28.1 | 31.17,28.28 R29.2 31.72,28.27 33.31,29.85 37.78,29.85 38.79,30.87 38.79,33.72 38.59,33.92 38.59,36.15 37.58,37.17 37.58,38.59 37.98,39 38.9,39 v38.95,38.95 38.74,38.95 | 49.31,47.18 IC2.27 49.24,46.19 48.75,45.7 48.75,43.11 v48.19,42.55
  Top 0.254: 28.74,28.28 28.75,28.27 R29.2
  Bottom 0.152: v38.95,38.95 41.84,41.84 47.28,41.84 v48.19,42.55
VBAT  (via drill 0.3)
  Top 0.152: 56.32,22.64 JP6.1
  Top 0.305: 56.32,23.1 54.85,24.57 v54.85,34.68
  Top 0.406: 56.32,22.64 56.32,23.1
  Bottom 0.152: 52.97,35.6 IC5.3
  Bottom 0.305: v54.85,34.68 54.7,34.68 53.71,35.67 IC5.3
  Bottom 0.406: IC5.3 50.66,35.67 C8.1 45.01,36.12 43.47,34.58 41.18,34.58 38.08,31.48 33.11,31.48 32.29,30.67 32.29,25.99 31.89,25.59 28.84,25.59 27.48,24.23 SW.2
  pour Bottom (isolate 0.305, no thermals): 54.04,35.54 48.35,35.54 48.35,36.97 54.04,36.97
VCC  (via drill 0.3)
  Top 0.203: 28.27,26.15 R28.2
  Top 0.305: R28.2 28.69,24.8 SW.1
  Top 0.406: v14,12.06 D4.C | D1.C 12.8,67.14 v11.9,68.03 | D2.C 67.39,69.2 v68.14,69.96 | D3.C 69.2,14.58 v69.86,13.92
  Bottom 0.203: 44.36,29.12 45.01,29.77 | R30.2 41.91,29.12 | C27.1 47.93,29.12
  Bottom 0.406: U3.7 44.36,29.12 | 45.01,29.77 U3.3 | 41.91,29.12 44.36,29.12 | 47.93,29.12 44.36,29.12 | C27.1 49.14,29.06 50.89,27.31 55.97,27.31 57.49,25.79 60.44,25.79 | 23.35,21.83 28.74,21.83 SW.1 33.45,23.29 34.93,24.77 37.56,24.77 R30.2 | 60.44,25.79 60.44,62.25 v68.14,69.96 68.71,70.53 69.16,70.53 JP2.P$2 | v14,12.06 JP3.P$2 12.82,10.8 23.35,21.34 23.35,21.83 | 23.35,21.83 21.64,23.54 21.64,23.92 21.62,27.21 21.62,58.37 11.52,68.42 | 70.56,13.23 JP4.P$2 70.88,12.9 v69.86,13.92 60.44,23.34 60.44,25.38 60.44,25.79 | JP1.P$2 11.1,68.83 11.52,68.42 | 11.52,68.42 v11.9,68.03
  pour Bottom (isolate 0.305, no thermals): 40.83,30.06 51.39,30.06 51.39,28.23 40.83,28.23
VIN  (via drill 0.3)
  Top 0.152: 54.34,39.1 54.59,39.1 v54.8,39.05 55.71,39.05 56.68,40.01 56.68,43.27 v55.86,44.08 | 54.34,39.1 X3.VBUS 53.44,39.2 53.02,39.2 | 54.64,39.2 54.34,39.1
  Top 0.203: v59.57,26.55 59.57,25.13 59.64,25.13 CHG.A
  Bottom 0.152: 58.15,35.29 C5.1 58.34,36.37 58.56,36.36 | R12.2 54.44,44.18 55.51,44.18 R13.2 55.91,44.13 v55.86,44.08 | v54.8,39.05 54.8,36.32 IC5.4
  Bottom 0.203: 58.15,35.29 59.67,35.29 59.67,26.55 v59.57,26.55
  Bottom 0.406: IC5.4 58.34,35.67 C5.1
  pour Bottom (isolate 0.305, no thermals): 54.85,35.34 54.85,36.97 59.72,36.97 59.72,34.73 56.47,34.73 56.47,35.34
  pour Bottom (isolate 0.305, no thermals): 54.85,35.14 54.85,36.97 59.72,36.97 59.72,34.53 56.47,34.53 56.47,35.14

### Text on the board
tPlace: Z | Y | X
tNames: M2 | M1 | Rev C | 2013 | M4 | M3
bNames: samuele@embeddedarea.com
tValues: M1